# EAGLE design shema (EAGLE 9.3.0)
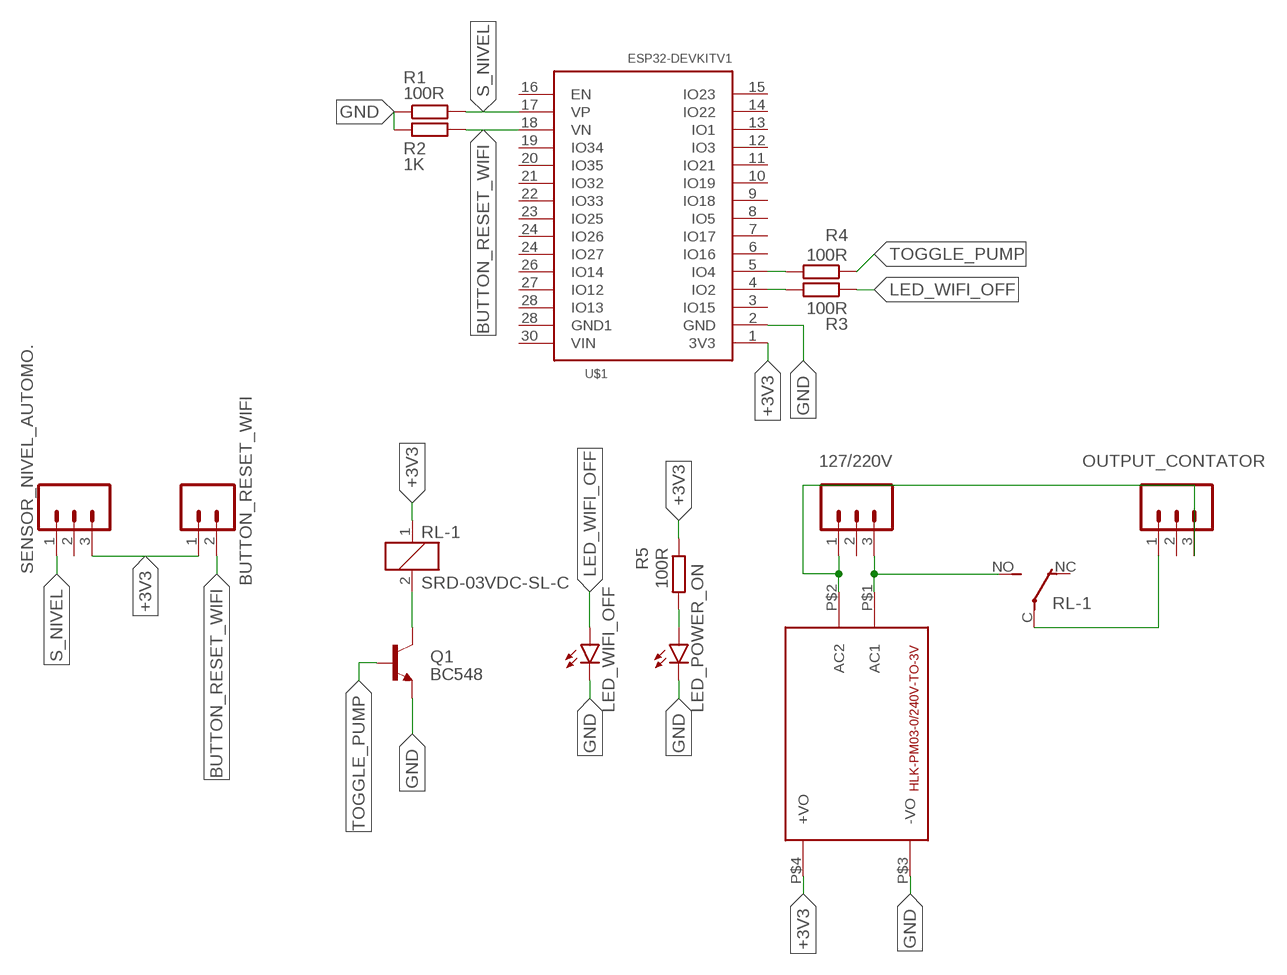
[diagram p0: schematic, sheet 1]

## Parts
127/220V  M03  [03P]
BUTTON_RESET_WIFI  M02  [02P]
HLK-PM03-0/240V-TO-3V  HLK-PM013W  [HLK-PM01]
LED_POWER_ON  LED3MM  [LED3MM]
LED_WIFI_OFF  LED3MM  [LED3MM]
OUTPUT_CONTATOR  M03  [03P]
Q1  BC548  [TO92-EBC]
R1  100R  R-EU_0207/10  [0207/10]
R2  1K  R-EU_0207/10  [0207/10]
R3  100R  R-EU_0207/10  [0207/10]
R4  100R  R-EU_0207/10  [0207/10]
R5  100R  R-EU_0207/10  [0207/10]
RL-1  SRD-03VDC-SL-C  CQ1-12V  [CQ1]
SENSOR_NIVEL_AUTOMO.  M03  [03P]
U$1  ESP32DEVKITV1  [ESP32-DEVKITV1]

## Nets
+3V3: BUTTON_RESET_WIFI.1 HLK-PM03-0/240V-TO-3V.P$4(+VO) R5.1 RL-1.1 SENSOR_NIVEL_AUTOMO..3 U$1.1(3V3)
BUTTON_RESET_WIFI: BUTTON_RESET_WIFI.2 R2.2 U$1.18(VN)
GND: HLK-PM03-0/240V-TO-3V.P$3(-VO) LED_POWER_ON.K(C) LED_WIFI_OFF.K(C) Q1.E R1.1 R2.1 U$1.2(GND)
LED_WIFI_OFF: LED_WIFI_OFF.A R3.1
N$1: R3.2 U$1.4(IO2)
N$2: 127/220V.3 HLK-PM03-0/240V-TO-3V.P$1(AC1) RL-1.NO(2:S)
N$3: R4.2 U$1.5(IO4)
N$4: Q1.C RL-1.2
N$5: OUTPUT_CONTATOR.1 RL-1.C(2:P)
N$6: 127/220V.1 HLK-PM03-0/240V-TO-3V.P$2(AC2) OUTPUT_CONTATOR.3
N$7: LED_POWER_ON.A R5.2
S_NIVEL: R1.2 SENSOR_NIVEL_AUTOMO..1 U$1.17(VP)
TOGGLE_PUMP: Q1.B R4.1
Unconnected: 127/220V.2 OUTPUT_CONTATOR.2 RL-1.NC(2:O) SENSOR_NIVEL_AUTOMO..2 U$1.3(IO15) U$1.6(IO16) U$1.7(IO17) U$1.8(IO5) U$1.9(IO18) U$1.10(IO19) U$1.11(IO21) U$1.12(IO3) U$1.13(IO1) U$1.14(IO22) U$1.15(IO23) U$1.16(EN) U$1.19(IO34) U$1.20(IO35) U$1.21(IO32) U$1.22(IO33) U$1.23(IO25) U$1.24(IO26) U$1.24(IO27) U$1.26(IO14) U$1.27(IO12) U$1.28(GND1) U$1.28(IO13) U$1.30(VIN)

## Library data of the parts
127/220V OUTPUT_CONTATOR SENSOR_NIVEL_AUTOMO. = con-amp-quick:M03: AMP QUICK CONNECTOR; OC_FARNELL: unknown; OC_NEWARK: unknown
BUTTON_RESET_WIFI = con-amp-quick:M02: AMP QUICK CONNECTOR; OC_FARNELL: unknown; OC_NEWARK: unknown
HLK-PM03-0/240V-TO-3V = HLK-PM01:HLK-PM01: Hi-Link Power Supply HLK-PM01 3W Author: Ahmed Said <https://github.com/AhmedSaid/EAGLELibraries>
LED_POWER_ON LED_WIFI_OFF = led:LED: LED OSRAM: - CHIPLED LG R971, LG N971, LY N971, LG Q971, LY Q971, LO R971, LY R971 LH N974, LH R974 LS Q976, LO Q976, LY Q976 LO Q996 - Hyper CHIPLED LW Q18S LB Q993, LB Q99A, LB R99A - SideLED LS A670, LO A670, LY A670, LG A670, LP A670 LB A673, LV A673, LT A673, LW A673 LH A674 LY A675 LS A676, LA A676, LO A676, LY A676, LW A676 LS A679, LY A679, LG A679 - Hyper Micro SIDELED® LS Y876, LA Y876, LO Y876, LY Y876 LT Y87S - SmartLED LW L88C, LW L88S LB L89C, LB L89S, LG L890 LS L89K, LO L89K, LY L89K LS L896, LA L896, LO L896, LY L896 - TOPLED LS T670, LO T670, LY T670, LG T670, LP T670 LSG T670, LSP T670, LSY T670, LOP T670, LYG T670 LG T671, LOG T671, LSG T671 LB T673, LV T673, LT T673, LW T673 LH T674 LS T676, LA T676, LO T676, LY T676, LB T676, LH T676, LSB T676, LW T676 LB T67C, LV T67C, LT T67C, LS T67K, LO T67K, LY T67K, LW E67C LS E67B, LA E67B, LO E67B, LY E67B, LB E67C, LV E67C, LT E67C LW T67C LS T679, LY T679, LG T679 LS T770, LO T770, LY T770, LG T770, LP T770 LB T773, LV T773, LT T773, LW T773 LH T774 LS E675, LA E675, LY E675, LS T675 LS T776, LA T776, LO T776, LY T776, LB T776 LHGB T686 LT T68C, LB T68C - Hyper Mini TOPLED® LB M676 - Mini TOPLED Santana® LG M470 LS M47K, LO M47K, LY M47K Source: http://www.osram.convergy.de LUXEON: - LUMILED® LXK2-PW12-R00, LXK2-PW12-S00, LXK2-PW14-U00, LXK2-PW14-V00 LXK2-PM12-R00, LXK2-PM12-S00, LXK2-PM14-U00 LXK2-PE12-Q00, LXK2-PE12-R00, LXK2-PE12-S00, LXK2-PE14-T00, LXK2-PE14-U00 LXK2-PB12-K00, LXK2-PB12-L00, LXK2-PB12-M00, LXK2-PB14-N00, LXK2-PB14-P00, LXK2-PB14-Q00 LXK2-PR12-L00, LXK2-PR12-M00, LXK2-PR14-Q00, LXK2-PR14-R00 LXK2-PD12-Q00, LXK2-PD12-R00, LXK2-PD12-S00 LXK2-PH12-R00, LXK2-PH12-S00 LXK2-PL12-P00, LXK2-PL12-Q00, LXK2-PL12-R00 Source: www.luxeon.com KINGBRIGHT: KA-3528ASYC Source: www.kingbright.com
Q1 = transistor-npn:BC548*: NPN Transistor
R1-R5 = rcl:R-EU_: RESISTOR, European symbol; SPICEPREFIX: R
RL-1 = relay:CQ1-12V: AUTOMOTIVE QUIET RELAY NAiS Source: http://www.mew-europe.com/.. en_ds_61208_0000.pdf; OC_FARNELL: unknown; OC_NEWARK: unknown
U$1 = ESP32-DEVKITV1:ESP32DEVKITV1

## Board
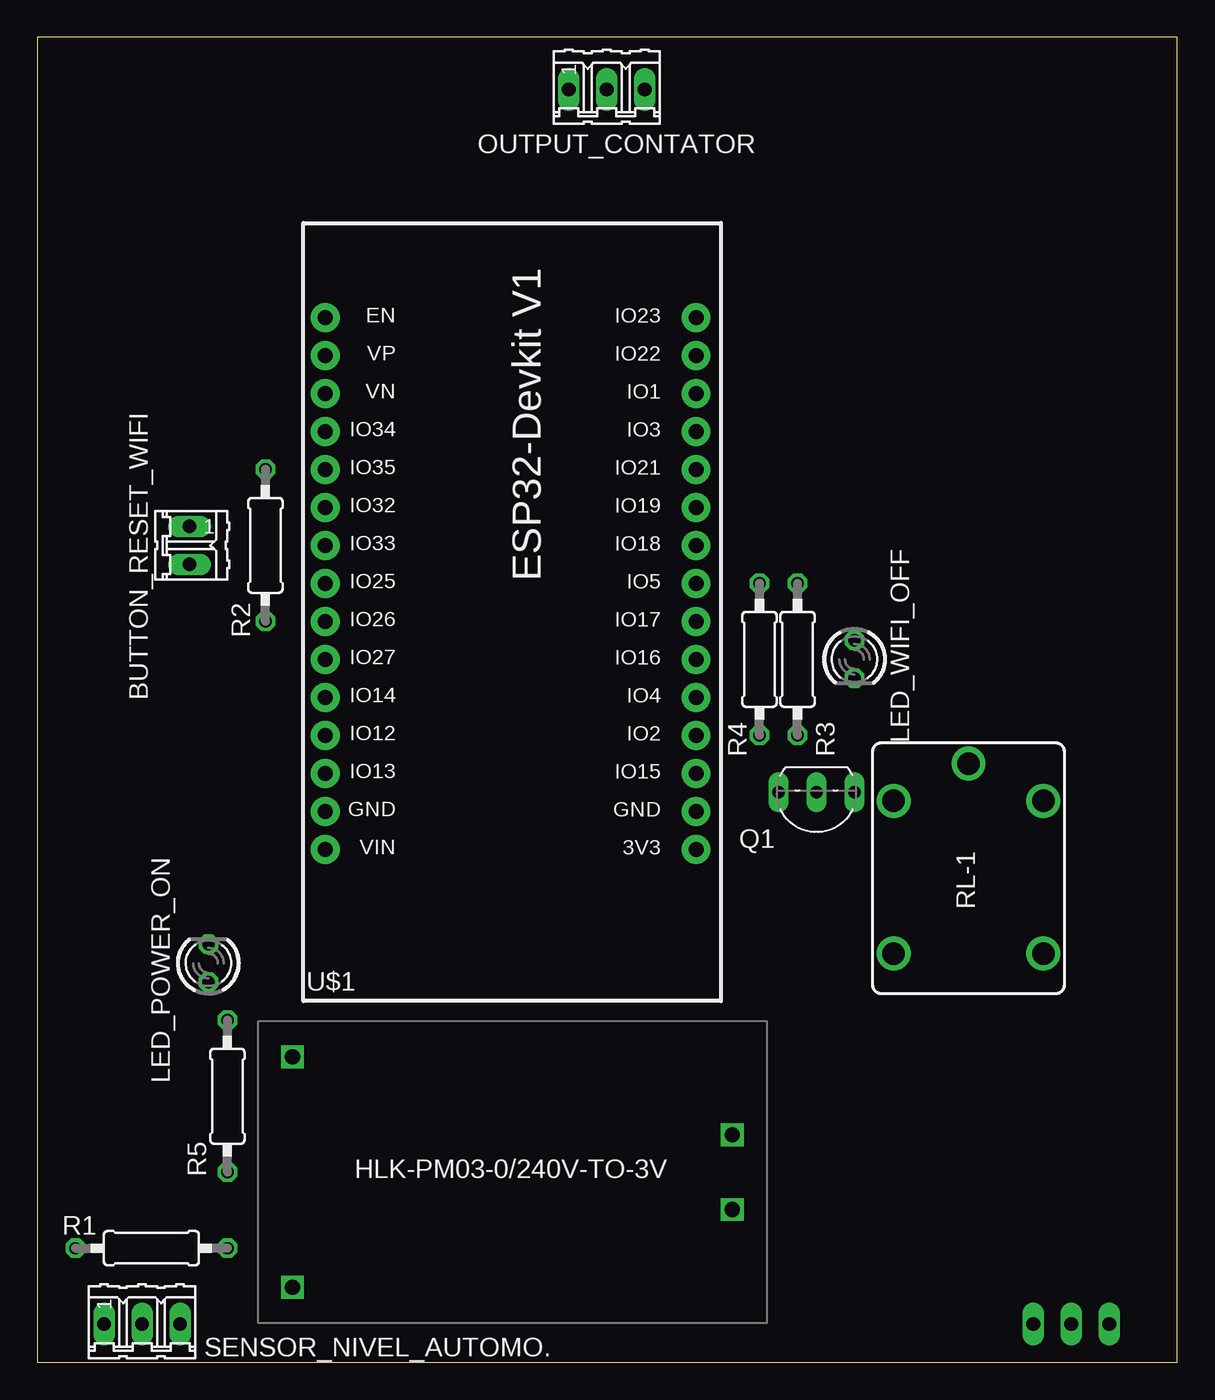
[diagram p1: board, top side]
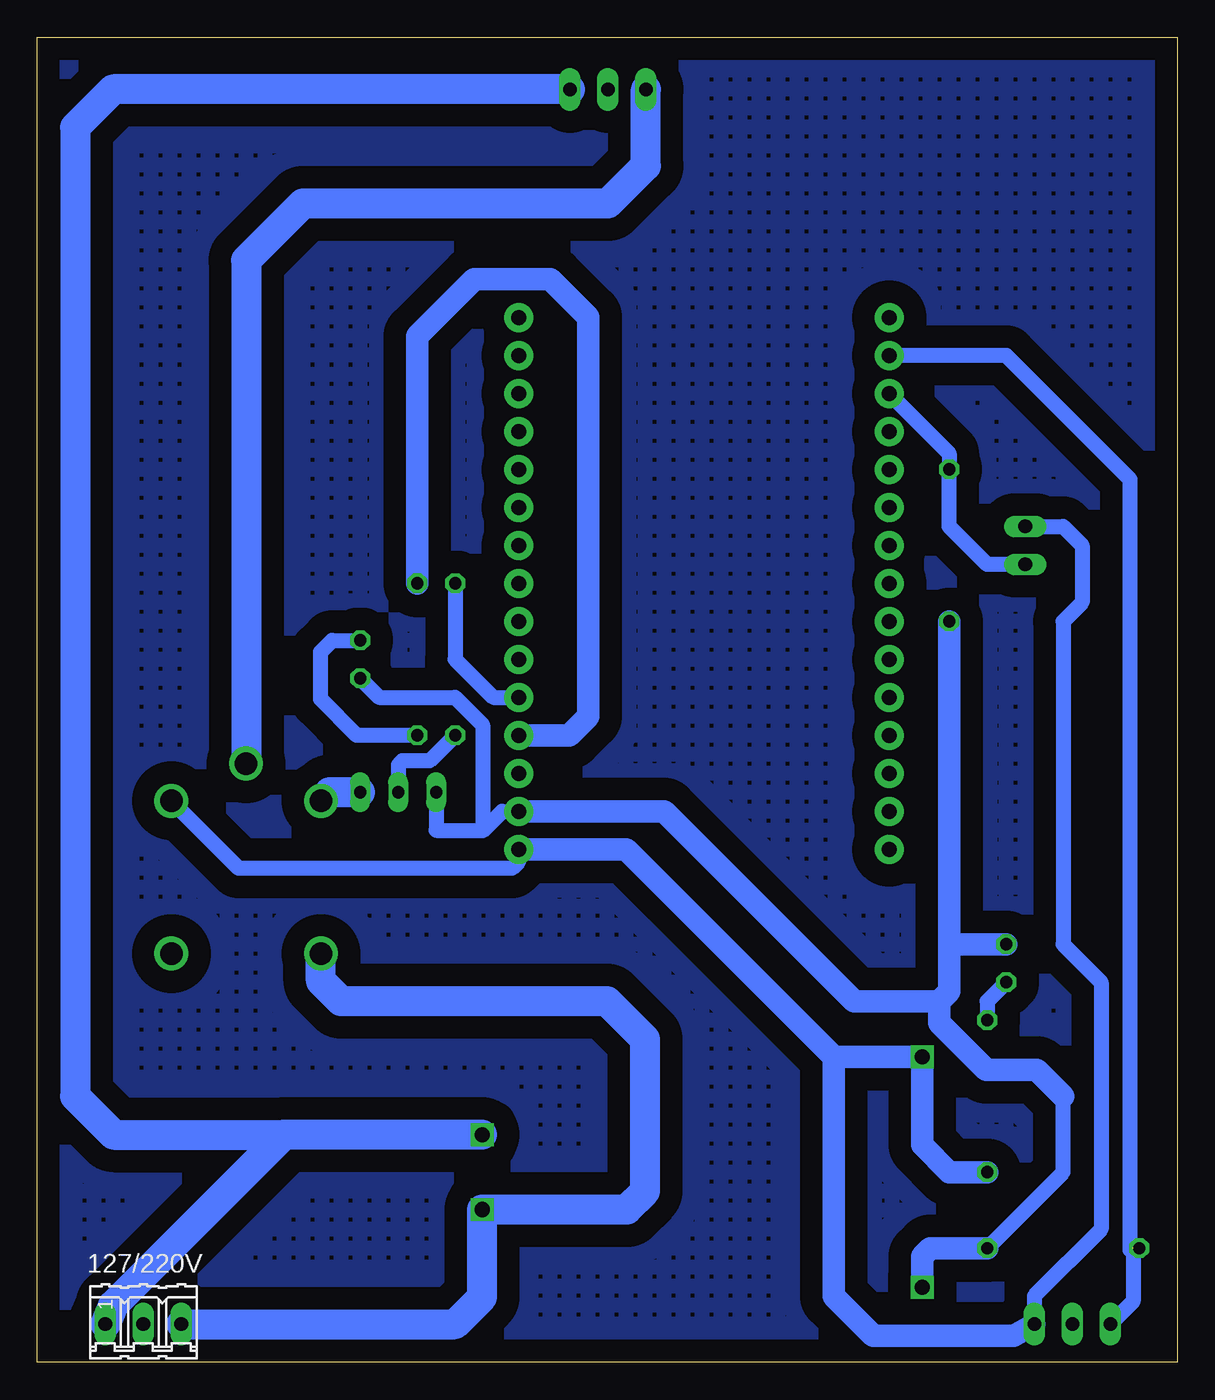
[diagram p2: board, bottom side, seen from below]

Size 76.18 x 88.57 mm. Coordinates in mm from the lower left corner, seen from the top.
Outline: 0,0 76.18,0 76.18,88.57 0,88.57 0,0
Copper layers (1*16): Top 0.035mm / dielectric 1.5mm / Bottom 0.035mm
Design rules "default": minimum track width 6mil, minimum drill 0.35mm, track to track 6mil, track to pad 6mil, pad to pad 6mil, via to via 6mil, smd to smd 6mil, copper to edge 40mil, drill to drill 6mil, minimum pad ring 10mil, minimum via ring 8mil, stop-mask expansion 4mil, vias tented up to drill 0mil, thermal gap 10mil

### Footprints (pad centres in the part's own frame; a part is rotated, then mirrored left to right if it is on the bottom)
03P = drill 0.914 long: 1 -2.54,0; 2 0,0; 3 2.54,0
02P = drill 0.914 long: 1 -1.27,0; 2 1.27,0
HLK-PM01 = drill 1.016 square: P$1 -14.7,2.5; P$2 -14.7,-2.5; P$3 14.7,7.7; P$4 14.7,-7.7
LED3MM = drill 0.813 octagon: A -1.27,0; K 1.27,0
TO92-EBC = drill 0.813 long: B 0,-1.27; C -2.54,-1.27; E 2.54,-1.27
0207/10 = drill 0.813 octagon: 1 -5.08,0; 2 5.08,0
CQ1 = drill 1.5: 1 4.5,-5; 2 4.5,5; C 7,0; NC -5.7,-5; NO -5.7,5
ESP32-DEVKITV1 = drill 1 pad 1.93: 1 -22.87,-13.54; 2 -20.33,-13.54; 3 -17.79,-13.54; 4 -15.25,-13.54; 5 -12.71,-13.54; 6 -10.17,-13.54; 7 -7.63,-13.54; 8 -5.09,-13.54; 9 -2.55,-13.54; 10 -0.01,-13.54; 11 2.53,-13.54; 12 5.07,-13.54; 13 7.61,-13.54; 14 10.15,-13.54; 15 12.69,-13.54; 16 12.69,11.23; 17 10.15,11.23; 18 7.61,11.23; 19 5.07,11.23; 20 2.53,11.23; 21 -0.01,11.23; 22 -2.55,11.23; 23 -5.09,11.23; 24 -7.63,11.23; 25 -10.17,11.23; 26 -12.71,11.23; 27 -15.25,11.23; 28 -17.79,11.23; 29 -20.33,11.23; 30 -22.87,11.23

### Placement (x,y rotation side)
127/220V  69.1,2.54 0 bottom
BUTTON_RESET_WIFI  10.16,54.61 270 top
HLK-PM03-0/240V-TO-3V  31.75,12.7 180 top
LED_POWER_ON  11.43,26.67 90 top
LED_WIFI_OFF  54.61,46.99 270 top
OUTPUT_CONTATOR  38.05,85.09 0 top
Q1  52.07,36.83 180 top
R1  7.62,7.62 180 top
R2  15.24,54.61 90 top
R3  50.8,46.99 90 top
R4  48.26,46.99 90 top
R5  12.7,17.78 90 top
RL-1  62.23,33.02 90 top
SENSOR_NIVEL_AUTOMO.  7,2.54 0 top
U$1  30.48,57.15 90 top

### Tracks (layer width: path | path; a pad name or v marks a point on that pad's centre or on a via)
+3V3
  Bottom 1: U$1.1 44.02,33.45 44.45,33.02 62.73,33.02 66.6,36.89 66.6,36.9 RL-1.1 | BUTTON_RESET_WIFI.1 7.62,55.88 6.35,54.61 6.35,50.8 7.62,49.53 7.62,27.94 5.08,25.4 5.08,8.89 9.54,4.43 SENSOR_NIVEL_AUTOMO..3
  Bottom 1.5: U$1.1 36.82,34.28 22.94,20.4 | 22.94,20.4 HLK-PM03-0/240V-TO-3V.P$4 17.05,14.51 15.24,12.7 R5.1 | 22.94,20.4 22.94,4.39 20.32,1.77 10.93,1.77 SENSOR_NIVEL_AUTOMO..3
  Bottom 2: RL-1.1
BUTTON_RESET_WIFI
  Bottom 1: BUTTON_RESET_WIFI.2 12.7,53.34 15.24,55.88 R2.2 15.24,60.75 U$1.18
GND
  Bottom 1: Q1.E 49.53,35.56 46.42,35.56 | U$1.2 45.12,36.82 46.42,35.52 46.42,35.56 | LED_WIFI_OFF.K 53.34,44.45 48.26,44.45 46.42,42.61 46.42,35.56 | R1.1 7.62,12.7 7.62,17.78
  Bottom 1.5: U$1.2 34.3,36.82 34.29,36.83 21.59,24.13 15.9,24.13 | R1.1 16.51,7.62 17.05,7.08 HLK-PM03-0/240V-TO-3V.P$3 | 7.62,17.78 9.39,19.55 12.77,19.55 15.9,22.68 15.9,24.13 | R2.1 15.24,27.8 | 15.24,27.8 15.24,24.79 15.9,24.13 | LED_POWER_ON.K 15.1,27.94 15.24,27.8
LED_WIFI_OFF
  Bottom 1: R3.1 54.84,41.91 57.25,44.32 57.25,47.49 56.48,48.26 LED_WIFI_OFF.A
N$1
  Bottom 1.5: U$1.4 40.64,41.91 39.37,43.18 39.37,69.85 41.91,72.39 46.99,72.39 50.8,68.58 R3.2
N$2
  Bottom 2: RL-1.NO 57.23,25.48 55.88,24.13 38.1,24.13 35.56,21.59 35.56,11.43 36.79,10.2 HLK-PM03-0/240V-TO-3V.P$1 46.45,4.35 48.26,2.54 127/220V.3
N$3
  Bottom 1: R4.2 48.26,46.99 45.71,44.44 U$1.5
N$4
  Bottom 2: Q1.C 56.65,38.1 RL-1.2
N$5
  Bottom 2: RL-1.C 62.23,73.66 58.42,77.47 38.03,77.47 35.51,79.99 OUTPUT_CONTATOR.1
N$6
  Bottom 2: HLK-PM03-0/240V-TO-3V.P$2 59.73,15.2 | 59.73,15.2 71.12,3.81 127/220V.1 | 59.73,15.2 71.08,15.2 73.66,17.78 73.66,82.55 71.12,85.09 OUTPUT_CONTATOR.3
N$7
  Bottom 1: LED_POWER_ON.A 12.7,24.13 R5.2
N$8
  pour Bottom (isolate 1.5, hatched): 0.6,88.1 0.6,0.6 75.5,0.6 75.5,88.1
S_NIVEL  (1 unrouted)
  Bottom 1: U$1.17 11.42,67.3 3.14,59.02 3.14,7.5 3.02,7.62 | R1.2 2.94,7.62 2.94,4.06 SENSOR_NIVEL_AUTOMO..1
TOGGLE_PUMP
  Bottom 1: Q1.B 52.05,38.1 52.05,39.95 51.8,40.2 49.97,40.2 R4.1